# Altium schematic sheet iso_sincs.SchDoc: Iso Sinc in/out & gpio
size A4; Author: Cassio Berni; DrawnBy: CCB; Revision: 1_01; SheetNumber: 3; SheetTotal: 4
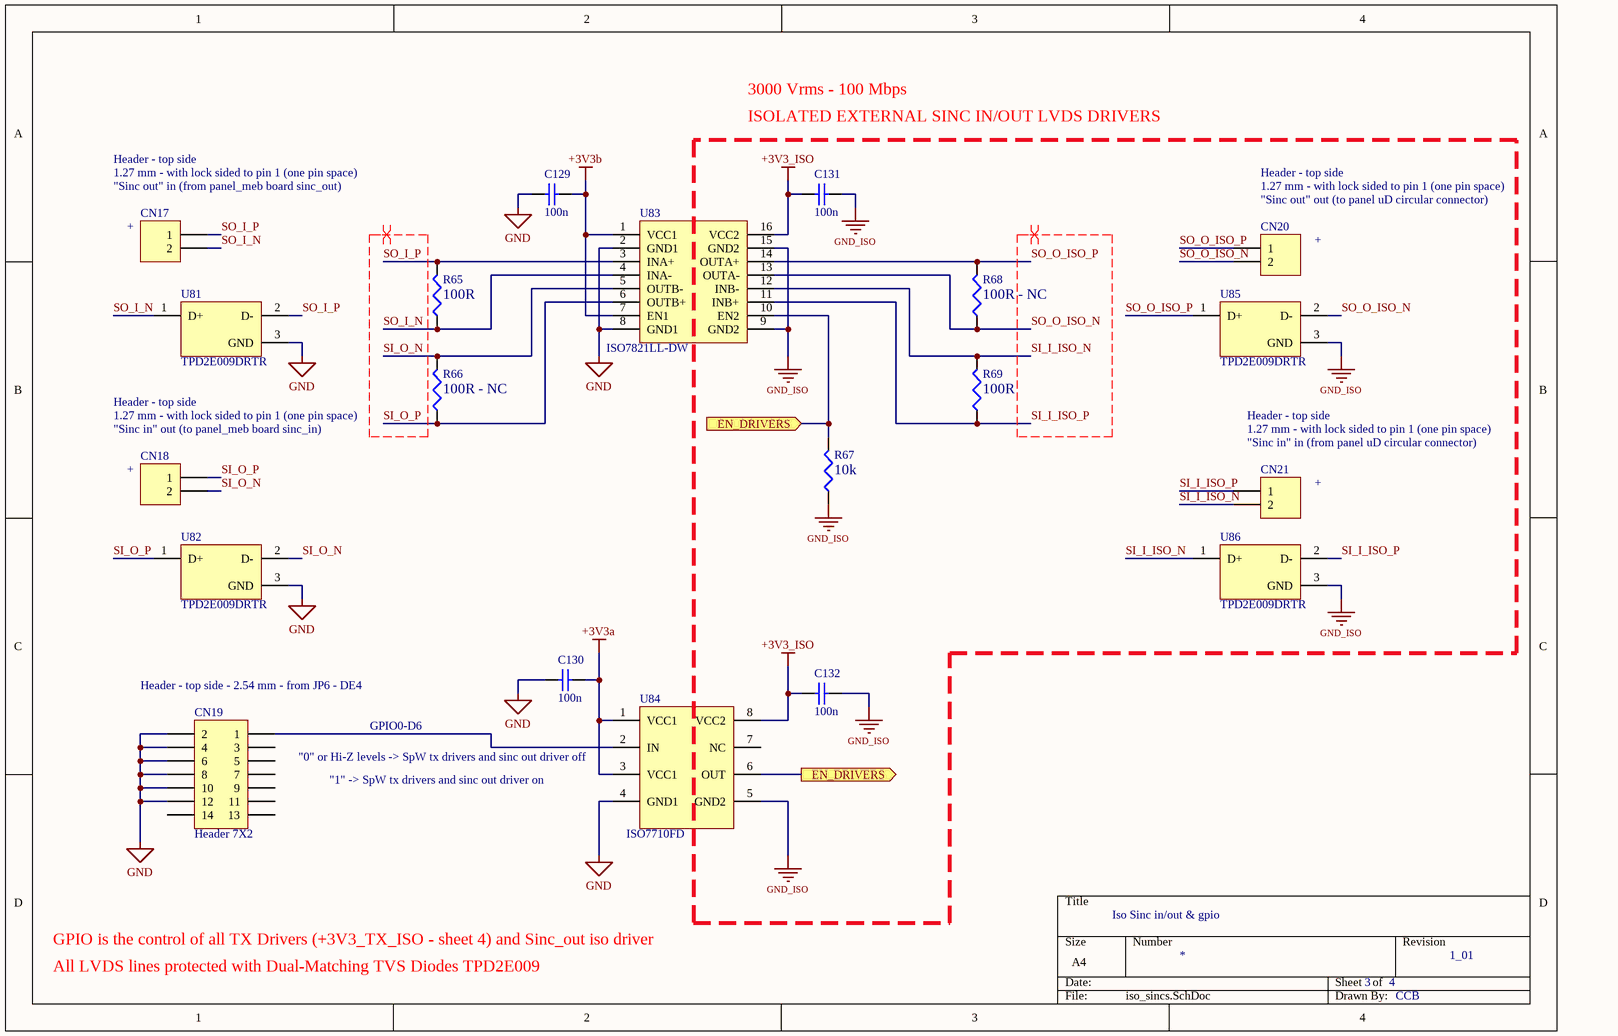
[diagram p0: iso_sincs.SchDoc]

## Parts
C129  Valor: 100n  [0402-cap]  (hidden comment: Capacitor Cerâmico SMD)
C130  Valor: 100n  [0402-cap]  (hidden comment: Capacitor Cerâmico SMD)
C131  Valor: 100n  [0402-cap]  (hidden comment: Capacitor Cerâmico SMD)
C132  Valor: 100n  [0402-cap]  (hidden comment: Capacitor Cerâmico SMD)
CN17  MHDR1X2  [MHDR1X2_AXONN]  (value not drawn)
CN18  MHDR1X2  [MHDR1X2_AXONN]  (value not drawn)
CN19  Header 7X2  [HDR2X7]
CN20  MHDR1X2  [MHDR1X2_AXONN]  (value not drawn)
CN21  MHDR1X2  [MHDR1X2_AXONN]  (value not drawn)
R65  Valor: 100R  [0402-res]  (hidden comment: Res3)
R66  Valor: 100R - NC  [0402-res]  (hidden comment: Res3)
R67  Valor: 10k  [0402-res]  (hidden comment: Res3)
R68  Valor: 100R - NC  [0402-res]  (hidden comment: Res3)
R69  Valor: 100R  [0402-res]  (hidden comment: Res3)
U81  TPD2E009DRTR  [DRT3]
U82  TPD2E009DRTR  [DRT3]
U83  ISO7821LL-DW  [SOIC-16-DW]
U84  ISO7710FD  [SOIC-8]
U85  TPD2E009DRTR  [DRT3]
U86  TPD2E009DRTR  [DRT3]

## Blocks framed on the sheet
ISOLATED EXTERNAL SINC IN/OUT LVDS DRIVERS: C131 C132 CN20 CN21 R67-R69 U83 U85 U86

## Ports
EN_DRIVERS (in), EN_DRIVERS (out)

## Nets
+3V3_ISO: C131.1 C132.2 U83.16(VCC2) U84.8(VCC2)
+3V3a: C130.1 U84.1(VCC1) U84.3(VCC1)
+3V3b: C129.2 U83.1(VCC1) U83.7(EN1)
GND: C129.1 C130.2 CN19.2 CN19.4 CN19.6 CN19.8 CN19.10 CN19.12 U81.3(GND) U82.3(GND) U83.2(GND1) U83.8(GND1) U84.4(GND1)
GND_ISO: C131.2 C132.1 R67.1 U83.9(GND2) U83.15(GND2) U84.5(GND2) U85.3(GND) U86.3(GND)
EN_DRIVERS: R67.2 U83.10(EN2) U84.6(OUT) ; port EN_DRIVERS
SI_I_ISO_N: CN21.2 R69.2 U83.12(INB-) U86.1(D+)
SI_I_ISO_P: CN21.1 R69.1 U83.11(INB+) U86.2(D-)
SI_O_N: CN18.2 R66.2 U82.2(D-) U83.5(OUTB-)
SI_O_P: CN18.1 R66.1 U82.1(D+) U83.6(OUTB+)
SO_I_N: CN17.2 R65.1 U81.1(D+) U83.4(INA-)
SO_I_P: CN17.1 R65.2 U81.2(D-) U83.3(INA+)
SO_O_ISO_N: CN20.2 R68.1 U83.13(OUTA-) U85.2(D-)
SO_O_ISO_P: CN20.1 R68.2 U83.14(OUTA+) U85.1(D+)
NetCN19_1: CN19.1 U84.2(IN)

Not connected (* = marked no-connect by the designer): CN19 3 5 7 9 11 13 14; U84 7(NC)

## Layout directives
differential pair; net class SOI_SIO; rule Differential Pairs Routing [Pref Gap = 10mil    Min Gap  = 10mil    Max Gap  = 10milPref Width = 10mil    Min Width  = 10mil    Max Width  = 10mil]: SI_O_N, SI_O_P, SO_I_N, SO_I_P
differential pair; net class SOO_SII_ISO; rule Differential Pairs Routing [Pref Gap = 10mil    Min Gap  = 10mil    Max Gap  = 10milPref Width = 10mil    Min Width  = 10mil    Max Width  = 10mil]: SI_I_ISO_N, SI_I_ISO_P, SO_O_ISO_N, SO_O_ISO_P

## Notes on the sheet
- 3000 Vrms - 100 Mbps
- Header - top side
- 1.27 mm - with lock sided to pin 1 (one pin space)
- (near CN17) "Sinc out" in (from panel_meb board sinc_out)
- (near CN17) +
- (near CN20) "Sinc out" out (to panel uD circular connector)
- +
- (near R66) 1.27 mm - with lock sided to pin 1 (one pin space)
- (near CN18) "Sinc in" out (to panel_meb board sinc_in)
- (near CN21) "Sinc in" in (from panel uD circular connector)
- (near CN18) +
- (near CN19) Header - top side - 2.54 mm - from JP6 - DE4
- (near U84) "0" or Hi-Z levels -> SpW tx drivers and sinc out driver off
- (near U84) "1" -> SpW tx drivers and sinc out driver on
- GPIO0-D6
- All LVDS lines protected with Dual-Matching TVS Diodes TPD2E009
- GPIO is the control of all TX Drivers (+3V3_TX_ISO - sheet 4) and Sinc_out iso driver

## Library data of the parts
CN17 CN18 CN20 CN21 = MHDR1X2: Header, 2-Pin; Valor: Header 1.27 mm - 2 vias; LatestRevisionDate: 17-Jul-2002; LatestRevisionNote: Re-released for DXP Platform.; Publisher: Altium Limited
CN19 = Header 7X2: Header, 7-Pin, Dual row; LatestRevisionDate: 17-Jul-2002; LatestRevisionNote: Re-released for DXP Platform.; Publisher: Altium Limited
R65-R69 = Res3: Resistor; Grupo: 01
U81 U82 U85 U86 = TPD2E009DRTR: ESD Protection Array for High-Speed Data Interfaces, 2 Channels, -40 to +85 degC, 3-pin SOT (DRT), Green (RoHS & no Sb/Br); Manufacturer: Texas Instruments; Breakdown Voltage(Min)(V): 9; Differential Capacitance(pF): 0.01; IEC 61000-4-2 Air-Gap(+/- kV): 8; IO Capacitance(Typ)(pF): 0.7; IO Leakage Current(nA): 10; Serial ATA / eSATA: TRUE; SubFamily: ESD Solution; DatasheetVersion: SLVS953A; PackageVersion: revD, Jun-2008; PackageReference: DRT3; PackageDescription: 3-Flat Lead Plastic Small Outline, 1 x 1 mm (inc leads), 0.35 mm Pitch; Supplier 1: Digi-Key; Supplier Part Number 1: 296-25410-2-ND; Supplier 2: Digi-Key; Supplier Part Number 2: 296-25410-1-ND; Supplier 3: Digi-Key; Supplier Part Number 3: 296-25410-6-ND; Supplier 4: Newark; Supplier Part Number 4: 50R8093; Supplier 5: Mouser; Supplier Part Number 5: 595-TPD2E009DRTR; Eco-Plan: Green (RoHS & no Sb/Br); IEC 61000-4-2 Contact(+/- kV): 8; Mounting Technology: Surface Mount; PartNumber: TPD2E009DRTR; ComponentLink1Description: Datasheet; ComponentLink1URL: http://www.ti.com/general/docs/lit/getliterature.tsp?genericPartNumber=TPD2E009&fileType=pdf; ComponentLink2Description: URL Link1; ComponentLink2URL: SamplesURL:http://www.ti.com/product/tpd2e009#samples
U83 = ISO7821LL-DW: High-Performance, 8000-VPK Reinforced Isolated Dual-LVDS Buffer; Publisher: Altium Limited; ComponentLink1Description: Manufacturer Link; ComponentLink1URL: http://www.ti.com/; ComponentLink2Description: Datasheet
U84 = ISO7710FD: High Speed, Robust EMC Reinforced Single-Channel Digital Isolator; ComponentAvailability: Obsolete; LatestRevisionNote: Stylized 3D Model Added.; PackageReference: SOIC-8; Publisher: Altium Limited; PackageDescription: DFP; 8 Leads; Body 4.9 x 3.9 mm (LxW max); Pitch 1.27 mm; Code_JEDEC: MO-092-AA; ComponentLink1Description: Manufacturer Link; ComponentLink1URL: http://www.ti.com/; ComponentLink2Description: Datasheet